# EasyEDA Pro project ProPrj_Sandro OrangePi CM5 Carrier Board_2024-09-12.epro, schematic Schematics

## Sheets
1 CM4 Carrier: Board Name: Board; Create Date: 2024-09-04; Page Name: CM4 Carrier; Project Name: Sandro OrangePi CM5 Carrier Board; Schematic Name: Schematics; Update Date: 2024-09-11
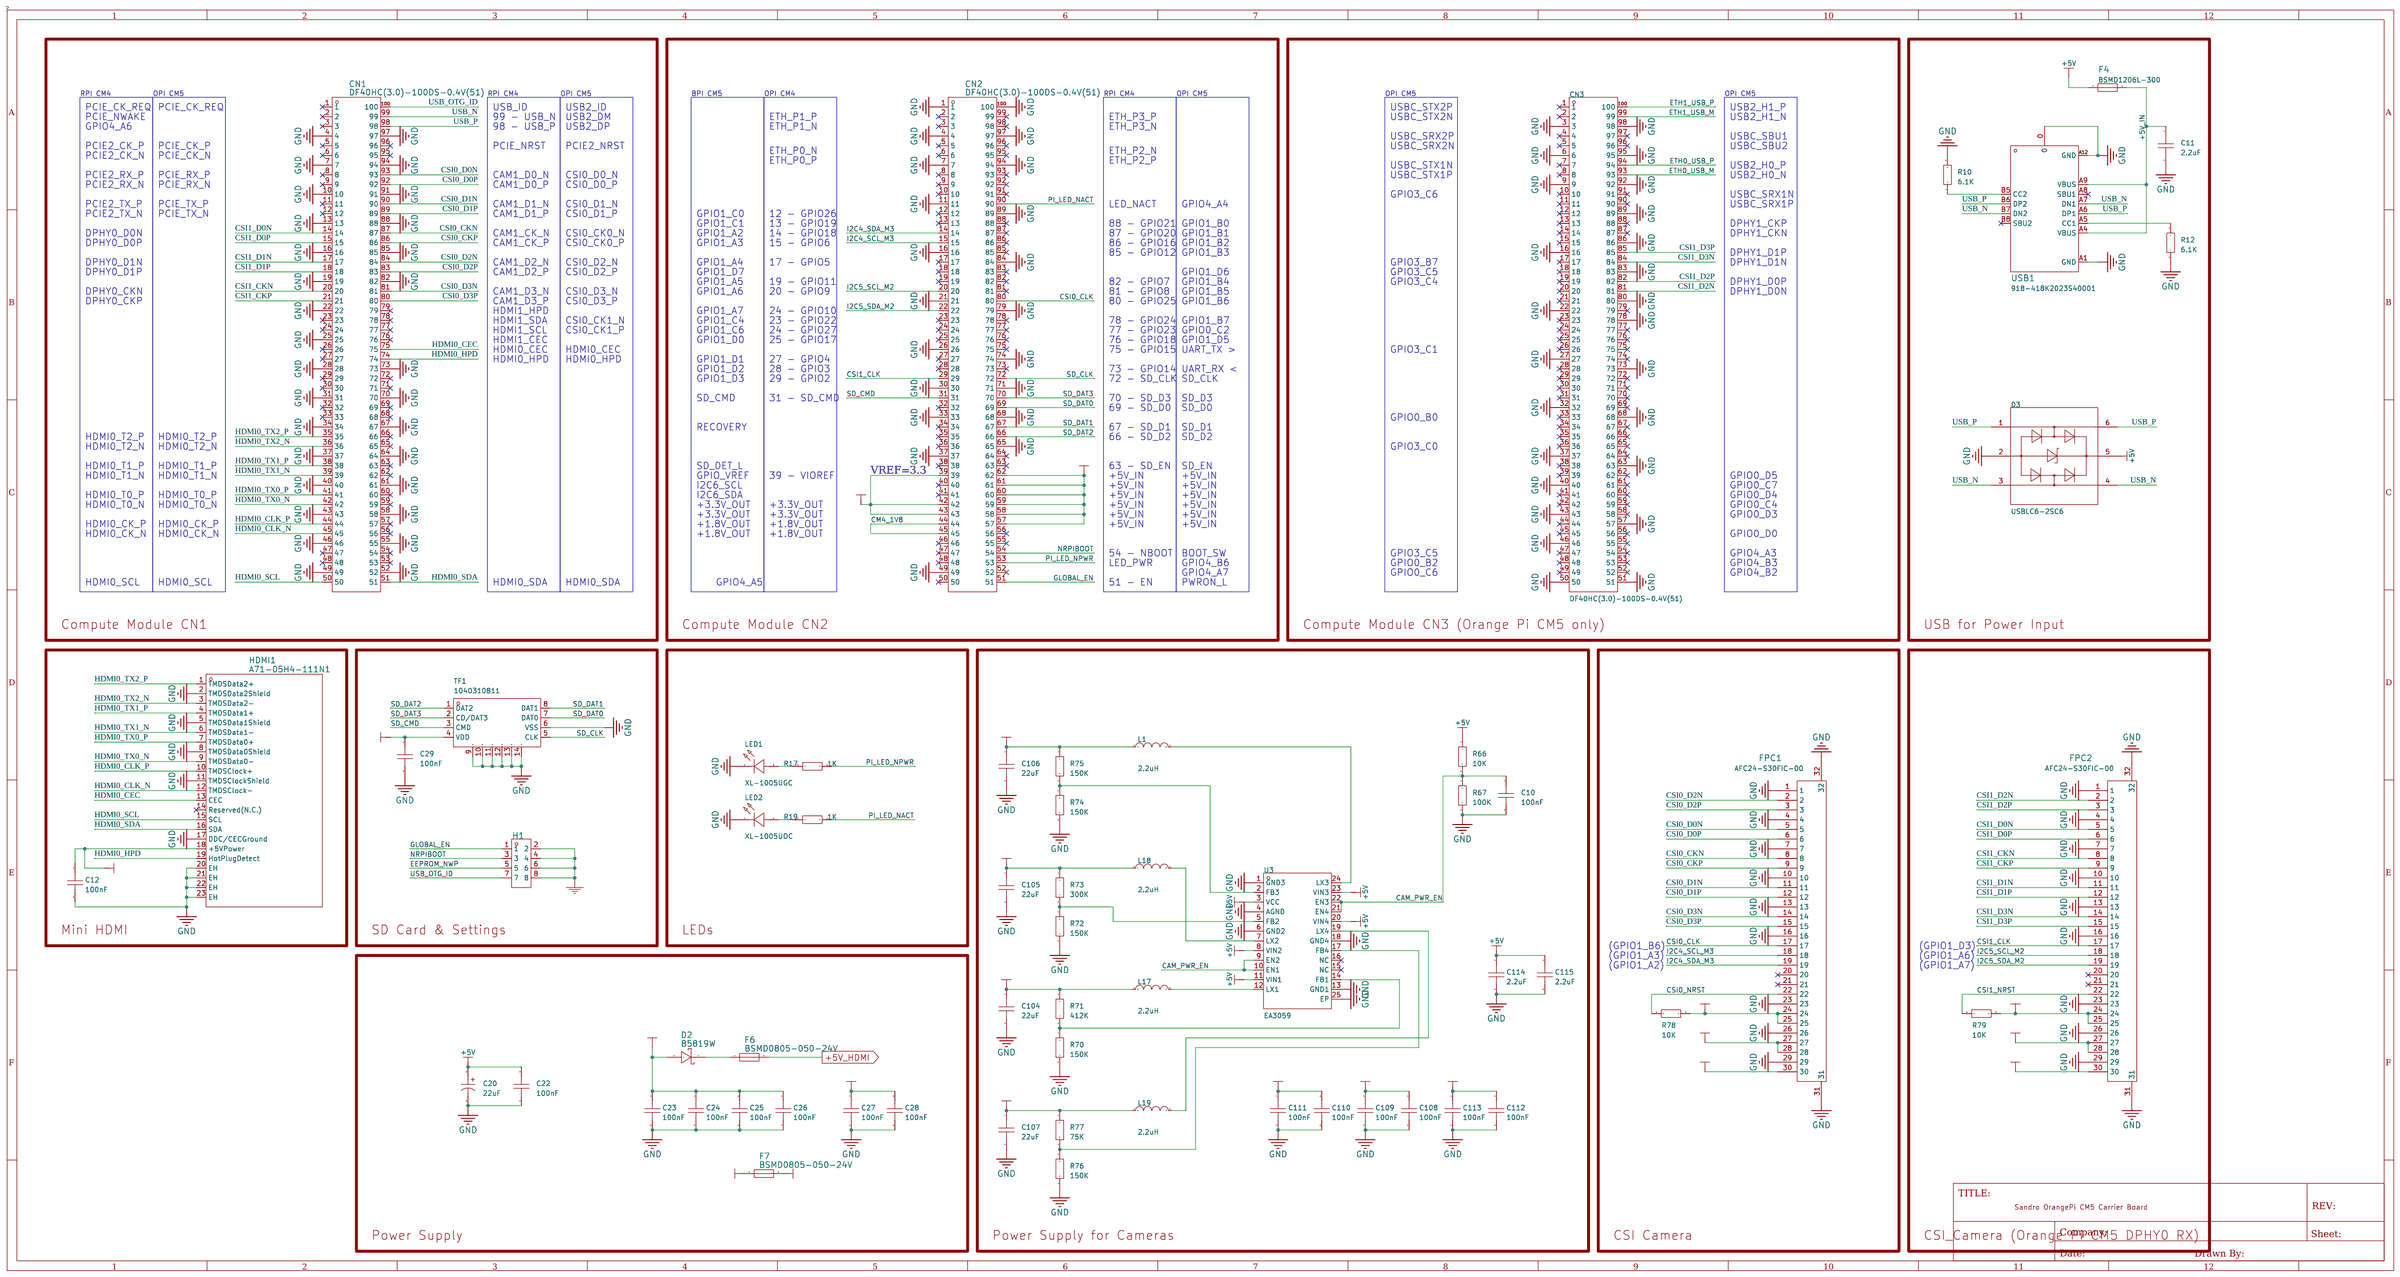
[diagram p0: CM4 Carrier]
2 2.Ethernet: Create Date: 2024-09-05
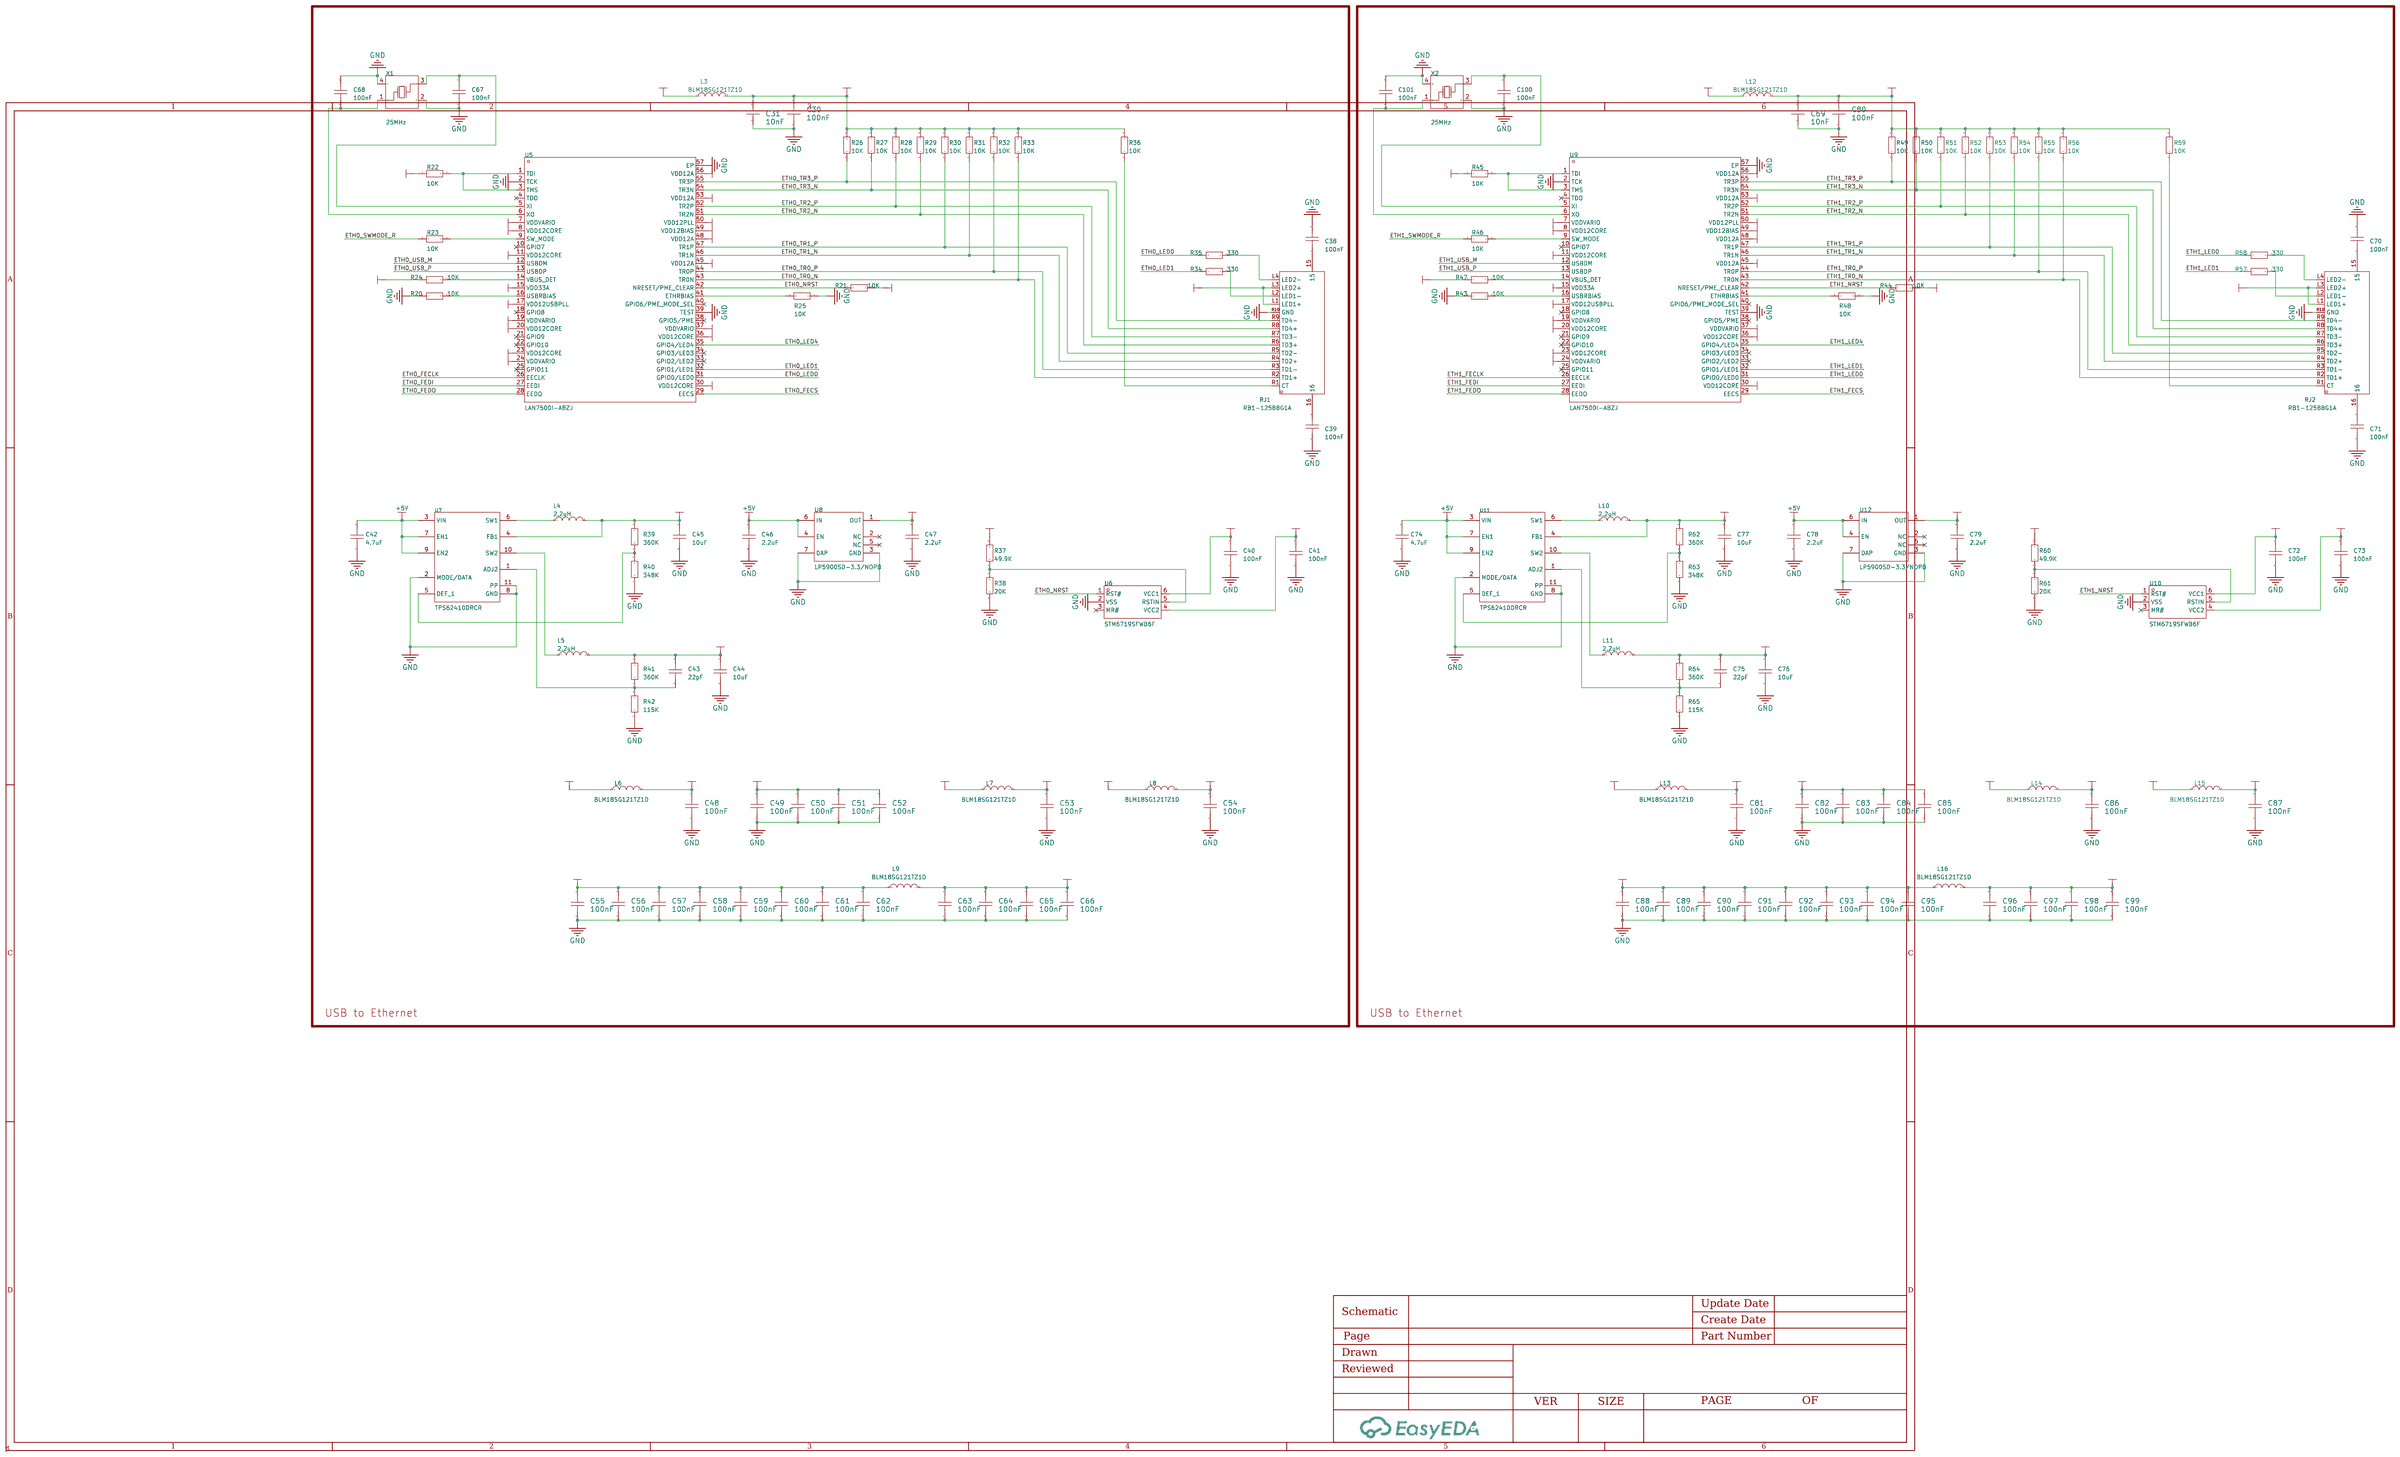
[diagram p1: 2.Ethernet]

## Parts
sheet 2.Ethernet
C30  100nF  [C0402]
C31  10nF  [C0402]
C38  100nF  [C0805]
C39  100nF  [C0805]
C40  100nF  [C0402]
C41  100nF  [C0402]
C42  4.7uF  [C0603]
C43  22pF  [C0402]
C44  10uF  [C0603]
C45  10uF  [C0603]
C46  2.2uF  [C0603]
C47  2.2uF  [C0603]
C48  100nF  [C0201]
C49  100nF  [C0201]
C50  100nF  [C0201]
C51  100nF  [C0201]
C52  100nF  [C0201]
C53  100nF  [C0201]
C54  100nF  [C0201]
C55  100nF  [C0201]
C56  100nF  [C0201]
C57  100nF  [C0201]
C58  100nF  [C0201]
C59  100nF  [C0201]
C60  100nF  [C0201]
C61  100nF  [C0201]
C62  100nF  [C0201]
C63  100nF  [C0201]
C64  100nF  [C0201]
C65  100nF  [C0201]
C66  100nF  [C0201]
C67  100nF  [C0201]
C68  100nF  [C0201]
C69  10nF  [C0402]
C70  100nF  [C0805]
C71  100nF  [C0805]
C72  100nF  [C0402]
C73  100nF  [C0402]
C74  4.7uF  [C0603]
C75  22pF  [C0402]
C76  10uF  [C0603]
C77  10uF  [C0603]
C78  2.2uF  [C0603]
C79  2.2uF  [C0603]
C80  100nF  [C0402]
C81  100nF  [C0201]
C82  100nF  [C0201]
C83  100nF  [C0201]
C84  100nF  [C0201]
C85  100nF  [C0201]
C86  100nF  [C0201]
C87  100nF  [C0201]
C88  100nF  [C0201]
C89  100nF  [C0201]
C90  100nF  [C0201]
C91  100nF  [C0201]
C92  100nF  [C0201]
C93  100nF  [C0201]
C94  100nF  [C0201]
C95  100nF  [C0201]
C96  100nF  [C0201]
C97  100nF  [C0201]
C98  100nF  [C0201]
C99  100nF  [C0201]
C100  100nF  [C0201]
C101  100nF  [C0201]
L3  BLM18SG121TZ1D  [L0603]
L4  2.2uH  [IND-SMD_L2.0-W1.6]
L5  2.2uH  [IND-SMD_L2.0-W1.6]
L6  BLM18SG121TZ1D  [L0603]
L7  BLM18SG121TZ1D  [L0603]
L8  BLM18SG121TZ1D  [L0603]
L9  BLM18SG121TZ1D  [L0603]
L10  2.2uH  [IND-SMD_L2.0-W1.6]
L11  2.2uH  [IND-SMD_L2.0-W1.6]
L12  BLM18SG121TZ1D  [L0603]
L13  BLM18SG121TZ1D  [L0603]
L14  BLM18SG121TZ1D  [L0603]
L15  BLM18SG121TZ1D  [L0603]
L16  BLM18SG121TZ1D  [L0603]
R20  10K  [R0201]
R21  10K  [R0201]
R22  10K  [R0201]
R23  10K  [R0201]
R24  10K  [R0201]
R25  10K  [R0201]
R26  10K  [R0201]
R27  10K  [R0201]
R28  10K  [R0201]
R29  10K  [R0201]
R30  10K  [R0201]
R31  10K  [R0201]
R32  10K  [R0201]
R33  10K  [R0201]
R34  330  [R0402]
R35  330  [R0402]
R36  10K  [R0201]
R37  49.9K  [R0402]
R38  20K  [R0402]
R39  360K  [R0402]
R40  348K  [R0402]
R41  360K  [R0402]
R42  115K  [R0402]
R43  10K  [R0201]
R44  10K  [R0201]
R45  10K  [R0201]
R46  10K  [R0201]
R47  10K  [R0201]
R48  10K  [R0201]
R49  10K  [R0201]
R50  10K  [R0201]
R51  10K  [R0201]
R52  10K  [R0201]
R53  10K  [R0201]
R54  10K  [R0201]
R55  10K  [R0201]
R56  10K  [R0201]
R57  330  [R0402]
R58  330  [R0402]
R59  10K  [R0201]
R60  49.9K  [R0402]
R61  20K  [R0402]
R62  360K  [R0402]
R63  348K  [R0402]
R64  360K  [R0402]
R65  115K  [R0402]
RJ1  RB1-125B8G1A  [RJ45-TH_RB1-125B8G1A]
RJ2  RB1-125B8G1A  [RJ45-TH_RB1-125B8G1A]
U5  LAN7500I-ABZJ  [QFN-56_L8.0-W8.0-P0.50-BL-EP6.0]
U6  STM6719SFWB6F  [SOT-23-6_L2.9-W1.6-P0.95-LS2.9-BL]
U7  TPS62410DRCR  [VSON-10_L3.0-W3.0-P0.50-BL-EP1.65]
U8  LP5900SD-3.3/NOPB  [WSON-6_L2.0-W2.0-P0.65-BL-EP]
U9  LAN7500I-ABZJ  [QFN-56_L8.0-W8.0-P0.50-BL-EP6.0]
U10  STM6719SFWB6F  [SOT-23-6_L2.9-W1.6-P0.95-LS2.9-BL]
U11  TPS62410DRCR  [VSON-10_L3.0-W3.0-P0.50-BL-EP1.65]
U12  LP5900SD-3.3/NOPB  [WSON-6_L2.0-W2.0-P0.65-BL-EP]
X1  25MHz  [OSC-SMD_4P-L3.2-W2.5-BL]
X2  25MHz  [OSC-SMD_4P-L3.2-W2.5-BL]
sheet CM4 Carrier
C10  100nF  [C0201]
C11  2.2uF  [C0603]
C12  100nF  [C0402]
C20  22uF  [CAP-SMD_L3.2-W1.6]
C22  100nF  [C0603]
C23  100nF  [C0402]
C24  100nF  [C0402]
C25  100nF  [C0402]
C26  100nF  [C0402]
C27  100nF  [C0402]
C28  100nF  [C0402]
C29  100nF  [C0402]
C104  22uF  [C0603]
C105  22uF  [C0603]
C106  22uF  [C0603]
C107  22uF  [C0603]
C108  100nF  [C0402]
C109  100nF  [C0402]
C110  100nF  [C0402]
C111  100nF  [C0402]
C112  100nF  [C0402]
C113  100nF  [C0402]
C114  2.2uF  [C0402]
C115  2.2uF  [C0402]
CN1  DF40HC(3.0)-100DS-0.4V(51)  [CONN-SMD_DF40HC-3.0-100DS-0.4V-51]
CN2  DF40HC(3.0)-100DS-0.4V(51)  [CONN-SMD_DF40HC-3.0-100DS-0.4V-51]
CN3  DF40HC(3.0)-100DS-0.4V(51)  [CONN-SMD_DF40HC-3.0-100DS-0.4V-51]
D2  B5819W  [SOD-123_L2.7-W1.6-LS3.7-RD-1]
D3  USBLC6-2SC6  [SOT-23-6_L2.9-W1.6-P0.95-LS2.8-BL]
F4  BSMD1206L-300  [F1206]
F6  BSMD0805-050-24V  [F0805]
F7  BSMD0805-050-24V  [F0805]
FPC1  AFC24-S30FIC-00  [FPC-SMD_P0.50-30P_QCHF-SM-H2.0]
FPC2  AFC24-S30FIC-00  [FPC-SMD_P0.50-30P_QCHF-SM-H2.0]
H1  2.54-2*4P立贴针  [HDR-SMD_8P-P2.54-V-M-R2-C4-LS7.4]
HDMI1  A71-05H4-111N1  [HDMI-SMD_A71-05H4-111N1]
L1  2.2uH  [IND-SMD_L2.0-W1.6]
L17  2.2uH  [IND-SMD_L2.0-W1.6]
L18  2.2uH  [IND-SMD_L2.0-W1.6]
L19  2.2uH  [IND-SMD_L2.0-W1.6]
LED1  XL-1005UGC  [LED0402-RD_GREEN]
LED2  XL-1005UOC  [LED0402-RD_ORANGE]
R10  6.1K  [R0402]
R12  6.1K  [R0402]
R17  1K  [R0402]
R19  1K  [R0402]
R66  10K  [R0201]
R67  100K  [R0201]
R70  150K  [R0201]
R71  412K  [R0201]
R72  150K  [R0201]
R73  300K  [R0201]
R74  150K  [R0201]
R75  150K  [R0201]
R76  150K  [R0201]
R77  75K  [R0201]
R78  10K  [R0402]
R79  10K  [R0402]
TF1  1040310811  [SIM-SMD_8P-1040310811]
U3  EA3059  [VQFN-24_L4.0-W4.0-P0.50-TL-EP2.5]
USB1  918-418K2023S40001  [USB-C-SMD_TYPE-C-USB-17]

## Library data of the parts
C30 C80 = GRM155R71H104KE14D: Capacitance: Tolerance:±10% Tolerance:±10% Voltage Rated: Temperature Coefficient:; LCSC Part Name: 100nF ±10% 50V; Supplier Part: C77020; Manufacturer: muRata(村田); Supplier Footprint: 0402; JLCPCB Part Class: Extended Part; Datasheet: https://atta.szlcsc.com/upload/public/pdf/source/20180326/C77020_39BD49C951FF1AF0DB1F1FAC5AC1E401.pdf; Supplier: LCSC; Tolerance: ±10%
C31 C69 = GRM155R71H103KA88D: Capacitance: Tolerance:±10% Tolerance:±10% Voltage Rated: Temperature Coefficient:; LCSC Part Name: 10nF ±10% 50V; Supplier Part: C77019; Manufacturer: muRata(村田); Supplier Footprint: 0402; JLCPCB Part Class: Extended Part; Datasheet: https://atta.szlcsc.com/upload/public/pdf/source/20180326/C77019_6A3693CE1BCE757D6A8B7C99DAE1B441.pdf; Supplier: LCSC; Tolerance: ±10%
C38 C39 C70 C71 = CAP_0805: Supplier Footprint: 0805
C12 C23-C29 C40 C41 C43 C72 C73 C75 C108-C115 = CAP_0402: Supplier Part: C1525; Supplier Footprint: 0402
C42 C74 = GRM188Z71C475KE21D: Capacitance: Tolerance:±10% Tolerance:±10% Voltage Rated: Temperature Coefficient:; LCSC Part Name: 4.7uF ±10% 16V; Supplier Part: C389010; Manufacturer: muRata(村田); Supplier Footprint: 0603; JLCPCB Part Class: Extended Part; Datasheet: https://atta.szlcsc.com/upload/public/pdf/source/20190418/C389010_378994D96815F6C3A9D8A85630794D48.pdf; Supplier: LCSC; Tolerance: ±10%
C11 C22 C44-C47 C76-C79 C104-C107 = CAP_0603: Supplier Footprint: 0603
C48-C66 C81-C99 = CAP_0201: Capacitance: Tolerance:±10% Tolerance:±10% Voltage Rated: Temperature Coefficient:; Supplier Footprint: 0201; LCSC Part Name: 100nF ±10% 50V; Datasheet: https://atta.szlcsc.com/upload/public/pdf/source/20180326/C77020_39BD49C951FF1AF0DB1F1FAC5AC1E401.pdf; Tolerance: ±10%
C10 C67 C68 C100 C101 = CAP_0201: Supplier Footprint: 0201
L3 L6-L9 L12-L16 = BLM18SG121TZ1D: Impedance @ Frequency:120Ω@100MHz Tolerance:±25% Tolerance:±25% DC Resistance:25mΩ Current Rating:3A Circuits:1; LCSC Part Name: 单路 0603磁珠 阻抗120Ω@100MHz; Supplier Part: C710390; Manufacturer: muRata(村田); Supplier Footprint: 0603; JLCPCB Part Class: Extended Part; Datasheet: https://atta.szlcsc.com/upload/public/pdf/source/20200713/C596493_97559AA8DE433E199BC44324FAB20584.pdf; Supplier: LCSC; Impedance @ Frequency: 120Ω@100MHz; Tolerance: ±25%; DC Resistance: 25mΩ; Current Rating: 3A; Circuits: 1
L1 L4 L5 L10 L11 L17-L19 = CKCS201610-2.2uH/M: Inductance: Tolerance:±20% Tolerance:±20% Rated Current: DC Resistance (DCR):; LCSC Part Name: 2.2uH ±20%; Supplier Part: C354533; Manufacturer: CENKER(岑科); Supplier Footprint: 0806; JLCPCB Part Class: Extended Part; Datasheet: https://atta.szlcsc.com/upload/public/pdf/source/20190315/C354623_FFFAD03D5912F156EAD6541D59E4BFA6.pdf; Supplier: LCSC; Tolerance: ±20%
R20-R33 R36 R43-R56 R59 R66 R67 R70-R77 = Res_0201: Supplier Footprint: 0201
R10 R12 R17 R19 R34 R35 R37-R42 R57 R58 R60-R65 R78 R79 = Res_0402: Supplier Footprint: 0402
RJ1 RJ2 = RB1-125B8G1A: Connector Type:RJ45Receptacle Number of Ports:1 Shielding:- LED:WithLED Ratings:-; LCSC Part Name: 带LED; Supplier Part: C363353; Manufacturer: UDE(涌德电子); Supplier Footprint: 插件; JLCPCB Part Class: Extended Part; Datasheet: https://atta.szlcsc.com/upload/public/pdf/source/20190109/C363353_EA6E4B83DC2B7D86FE894E4D2D926326.pdf; Supplier: LCSC; Connector Type: RJ45Receptacle; Number of Ports: 1; LED: WithLED
U5 U9 = LAN7500I-ABZJ: Supplier Part: C633487; Manufacturer: MICROCHIP(美国微芯); Supplier Footprint: QFN-56-EP(8x8); JLCPCB Part Class: Extended Part; Datasheet: https://atta.szlcsc.com/upload/public/pdf/source/20201223/C633487_9F806AA6E1D0B4E84D093B09D4D35190.pdf; Supplier: LCSC
U6 U10 = STM6719SFWB6F: ChipType:Multi-pressure monitor Output Type:开漏 Reset Active Level:低电平有效 Threshold Voltage:1.05V；2.925V Number of Voltages Monitored:3 Reset Timeout:140ms Operating Temperature:-40℃~+85℃@(TA) Operating Temperature:-40℃~+85℃@(TA); Supplier Part: C2066130; Manufacturer: ST(意法半导体); Supplier Footprint: SOT-23-6; JLCPCB Part Class: Extended Part; Datasheet: https://atta.szlcsc.com/upload/public/pdf/source/20191219/C472587_1763A85136DA7D01AAA8799638101CA1.pdf; Supplier: LCSC; ChipType: Multi-pressure monitor; Output Type: 开漏; Reset Active Level: 低电平有效; Threshold Voltage: 1.05V；2.925V; Number of Voltages Monitored: 3; Reset Timeout: 140ms; Operating Temperature: -40℃~+85℃@(TA)
U7 U11 = TPS62410DRCR: Function:Step-down type Output Type:Adjustable Input Voltage:2.5V~6V Input Voltage:2.5V~6V Output Voltage:600mV~6V Output Voltage:600mV~6V Output Current (Max):800mA Switching Frequency:2.25MHz Operating Temperature:-40℃~+85℃@(TA) Operating Temperature:-4; Supplier Part: C54570; Manufacturer: TI(德州仪器); Supplier Footprint: VSON-10-EP(3x3); JLCPCB Part Class: Extended Part; Datasheet: https://www.ti.com/cn/lit/gpn/tps62410; Supplier: LCSC; Function: Step-down type; Output Type: Adjustable; Input Voltage: 2.5V~6V; Output Voltage: 600mV~6V; Output Current (Max): 800mA; Switching Frequency: 2.25MHz; Operating Temperature: -40℃~+85℃@(TA); Synchronous Rectification: Yes; Number of Outputs: 2; Topology: Step-down; Switch tube (built-in/external): 内置
U8 U12 = LP5900SD-3.3/NOPB: Output Type:Fixed Maximum Input Voltage:5.5V Output Voltage:3.3V Output Voltage:3.3V Output Current:150mA Power Supply Rejection Ratio (PSRR):85dB Dropout Voltage:150mV@(150mA) Feature:防静电保护；Short-Circuit  Protection；低ESR；Thermal Protection(TSD)；欠压闭锁；带使能; LCSC Part Name: 具有使能功能的 150mA、低噪声、低 IQ、低压降稳压器; Supplier Part: C131975; Manufacturer: TI(德州仪器); Supplier Footprint: WSON-6-EP(2.2x2.5); JLCPCB Part Class: Extended Part; Datasheet: https://www.ti.com/cn/lit/gpn/lp5900; Supplier: LCSC; Output Type: Fixed; Maximum Input Voltage: 5.5V; Output Voltage: 3.3V; Output Current: 150mA; Power Supply Rejection Ratio (PSRR): 85dB; Dropout Voltage: 150mV@(150mA); Feature: 防静电保护；Short-Circuit  Protection；低ESR；Thermal Protection(TSD)；欠压闭锁；带使能; Output Polarity: Positive electrode; Number of Outputs: 1
X1 X2 = X322525MOB4SI: Crystal Type:Surface Mount Crystal Frequency: Normal temperature Frequency Tolerance:±10ppm Normal temperature Frequency Tolerance:±10ppm External load capacitor: Frequency Stability(Full temperature range):±20ppm Frequency Stability(Full temperature rang; LCSC Part Name: 25MHz ±10ppm 12pF; Supplier Part: C9006; Manufacturer: YXC(扬兴晶振); Supplier Footprint: SMD3225-4P; JLCPCB Part Class: Basic Part; Datasheet: https://atta.szlcsc.com/upload/public/pdf/source/20240329/19D5F850207469550BEB00D7DFEDBC7A.pdf; Supplier: LCSC; Crystal Type: Surface Mount Crystal; Normal temperature Frequency Tolerance: ±10ppm; Frequency Stability(Full temperature range): ±20ppm
C20 = CA45-A-16V-22uF-K: Capacitance: Tolerance:±10% Tolerance:±10% Rated Voltage: Equivalent Series Resistance(ESR):6Ω@100kHz Operating Temperature:-55℃~+125℃ Operating Temperature:-55℃~+125℃; LCSC Part Name: 22uF ±10% 16V; Supplier Part: C782264; Manufacturer: CEC(振华新云); Supplier Footprint: CASE-A-3216; JLCPCB Part Class: Extended Part; Datasheet: https://atta.szlcsc.com/upload/public/pdf/source/20200909/C782264_D6D9C4EF3B25E81633C26A9294FBB820.pdf; Supplier: LCSC; Tolerance: ±10%; Equivalent Series Resistance(ESR): 6Ω@100kHz; Operating Temperature: -55℃~+125℃
CN1 CN2 = DF40HC(3.0)-100DS-0.4V(51): link: https://item.szlcsc.com/418166.html; Supplier: LCSC; Supplier Part: C424649; Manufacturer: HRS(广濑); JLCPCB Part Class: Extended Part
CN3 = DF40HC(3.0)-100DS-0.4V(51): Number of Pins:- Pitch:0.4mm Gender:Female Mounting Style:Brick nogging Number of Rows:2 Current Rating (Max):300mA Contact Plating:Gold Operating Temperature Range:-35℃~+85℃ Operating Temperature Range:-35℃~+85℃; LCSC Part Name: 间距:0.4mm 母 立贴; Supplier Part: C424649; Manufacturer: HRS(广濑); Supplier Footprint: SMD,P=0.4mm; JLCPCB Part Class: Extended Part; Datasheet: https://atta.szlcsc.com/upload/public/pdf/source/20190903/C424648_4BEB475664B3701E3114D0DD20EED667.pdf; Supplier: LCSC; Pitch: 0.4mm; Gender: Female; Mounting Style: Brick nogging; Number of Rows: 2; Current Rating (Max): 300mA; Contact Plating: Gold; Operating Temperature Range: -35℃~+85℃
D2 = B5819W: link: https://atta.szlcsc.com/upload/public/pdf/source/20210423/C2828417_EF1BF8BE3D48F97E320B09B073C89160.pdf; Supplier: LCSC; Manufacturer: CJ; Supplier Part: C8598; JLCPCB Part Class: Basic Part
D3 = USBLC6-2SC6_C7519: polarity:Unidirectional Reverse Stand-Off Voltage (Vrwm):5.25V Maximum Clamping Voltage:17V Peak Pulse Current (Ipp)@10/1000us:5A Breakdown Voltage:6V Number of Lines:双路 Operating Temperature:-40℃~+125℃@(Tj) Operating Temperature:-40℃~+125℃@(Tj) Type:ESD; LCSC Part Name: 单向ESD; Supplier Part: C7519; Manufacturer: ST(意法半导体); Supplier Footprint: SOT-23-6; JLCPCB Part Class: Extended Part; Datasheet: https://atta.szlcsc.com/upload/public/pdf/source/20140724/1457707160627.pdf; Supplier: LCSC; polarity: Unidirectional; Reverse Stand-Off Voltage (Vrwm): 5.25V; Maximum Clamping Voltage: 17V; Peak Pulse Current (Ipp)@10/1000us: 5A; Breakdown Voltage: 6V; Number of Lines: 双路; Operating Temperature: -40℃~+125℃@(Tj); Type: ESD
F4 = BSMD1206L-300: Operating Voltage (Max):6V Current Rating (Max):50A Hold Current:3A Trip Current:6A Power Dissipation:1.2W Resistance - Initial (Ri) (Min):3mΩ Resistance - Post Trip (R1) (Max):30mΩ Maximum Time to Trip:5s Operating Temperature:-40℃~+85℃ Operating Tempera; LCSC Part Name: 1206 3A 6V 佰宏低电阻; Supplier Part: C960021; Manufacturer: BHFUSE(佰宏); Supplier Footprint: 1206; JLCPCB Part Class: Extended Part; Datasheet: https://atta.szlcsc.com/upload/public/pdf/source/20230512/A1E7B7D17B41A33ACDAB0D28E5E34190.pdf; Supplier: LCSC; Operating Voltage (Max): 6V; Current Rating (Max): 50A; Hold Current: 3A; Trip Current: 6A; Power Dissipation: 1.2W; Resistance - Initial (Ri) (Min): 3mΩ; Resistance - Post Trip (R1) (Max): 30mΩ; Maximum Time to Trip: 5s; Operating Temperature: -40℃~+85℃
F6 F7 = BSMD0805-050-24V: link: https://item.szlcsc.com/343298.html; 3DModel: F0805_L2.1-W1.4-H0.8; Supplier: LCSC; Supplier Part: C910822; Manufacturer: BHFUSE; JLCPCB Part Class: Extended Part
FPC1 FPC2 = AFC24-S30FIC-00: Locking Feature:Clamshell Contact Type:Double-sided contacts/up and down connection Number of Contacts:30P Pitch:0.5mm Mounting Type:卧贴 FFC, FCB Thickness:0.3mm FFC, FCB Thickness:0.3mm Height Above Board:2mm; LCSC Part Name: 间距:0.5mm P数:30P 翻盖式 双侧触点/上下接; Supplier Part: C262294; Manufacturer: JS(钜硕电子); Supplier Footprint: SMD,P=0.5mm,卧贴; JLCPCB Part Class: Extended Part; Datasheet: https://atta.szlcsc.com/upload/public/pdf/source/20180814/C262679_7FB2CAD07E71B2E22E52A118EE33337B.pdf; Supplier: LCSC; Locking Feature: Clamshell; Contact Type: Double-sided contacts/up and down connection; Number of Contacts: 30P; Pitch: 0.5mm; Mounting Type: 卧贴; FFC, FCB Thickness: 0.3mm; Height Above Board: 2mm
H1 = 2.54-2*4P立贴针: Pin Structure:2x4P Pitch:2.54mm Row Spacing:2.54mm Circluar Pins/Square Pins:Square Pins Mounting Type:Brick nogging Number of Rows:双排 Number of Pins:8P Current Rating (Max):3A Voltage Rating (Max):- Length of Mating Pin:6mm Insulation Height:2.5mm Length; LCSC Part Name: 间距:2.54mm 2x4P 立贴 方针; Supplier Part: C192300; Manufacturer: BOOMELE(博穆精密); Supplier Footprint: SMD,P=2.54mm; JLCPCB Part Class: Extended Part; Datasheet: https://atta.szlcsc.com/upload/public/pdf/source/20210812/F9D0E068B6990BF98BEA9D68FBD6ED36.pdf; Supplier: LCSC; Pin Structure: 2x4P; Pitch: 2.54mm; Row Spacing: 2.54mm; Circluar Pins/Square Pins: Square Pins; Mounting Type: Brick nogging; Number of Rows: 双排; Number of Pins: 8P; Current Rating (Max): 3A; Length of Mating Pin: 6mm; Insulation Height: 2.5mm; Operating Temperature Range: -55℃~+105℃; Color: Black
HDMI1 = A71-05H4-111N1: link: https://atta.szlcsc.com/upload/public/pdf/source/20210514/C2682170_4D6E5A791C7E19ACB30FBEFC75C1BA4F.pdf; Supplier: LCSC; Supplier Part: C2682170; Manufacturer: XKB Connectivity(中国星坤); JLCPCB Part Class: Extended Part
LED1 = XL-1005UGC_C965793: Emitted Color:Emerald Forward Voltage (VF):3V Forward Voltage (VF):3V Power Dissipation:80mW Forward Current:25mA Dominant Wavelength:516nm~531nm Dominant Wavelength:516nm~531nm Peak Wavelength:531nm Lens Color:Colorless and transparent Color Temperature:; Supplier Part: C965793; Manufacturer: XINGLIGHT(成兴光); Supplier Footprint: 0402; JLCPCB Part Class: Extended Part; Datasheet: https://atta.szlcsc.com/upload/public/pdf/source/20201230/C965793_0CDDD21E721E0FD2A4CEAFDFDBC3C135.pdf; Supplier: LCSC; Emitted Color: Emerald; Forward Voltage (VF): 3V; Power Dissipation: 80mW; Forward Current: 25mA; Dominant Wavelength: 516nm~531nm; Peak Wavelength: 531nm; Lens Color: Colorless and transparent; Luminous Intensity: 249mcd; Viewing Angle: 120°; Mounting Sytle: Positive Stick; Operating Temperature: -30℃~+85℃
LED2 = XL-1005UOC: Emitted Color:Orange Power Dissipation:55mW Forward Current:25mA Dominant Wavelength:600nm Dominant Wavelength:600nm Peak Wavelength:610nm Lens Color:无色透明透镜 Color Temperature:- Color Temperature:- Viewing Angle:120° Mounting Sytle:Positive post Operating; Supplier Part: C965791; Manufacturer: XINGLIGHT(成兴光); Supplier Footprint: 0402; JLCPCB Part Class: Extended Part; Datasheet: https://atta.szlcsc.com/upload/public/pdf/source/20221102/20343CDAB7C90B2E3EF3073DFAD545BA.pdf; Supplier: LCSC; Emitted Color: Orange; Power Dissipation: 55mW; Forward Current: 25mA; Dominant Wavelength: 600nm; Peak Wavelength: 610nm; Lens Color: 无色透明透镜; Viewing Angle: 120°; Mounting Sytle: Positive post; Operating Temperature: -30℃~+85℃
TF1 = 1040310811: Card Connection Mode:Pluggable Card Type:MicroSD卡(TF卡) Connector Type:Deck Maximum Body Height:1.42mm Contact Plating:Gold Operating Temperature Range:- Operating Temperature Range:-; LCSC Part Name: 拔插式 MicroSD卡(TF卡) 卡座; Supplier Part: C585350; Manufacturer: MOLEX; Supplier Footprint: SMD; JLCPCB Part Class: Extended Part; Datasheet: https://atta.szlcsc.com/upload/public/pdf/source/20201117/C585350_D1F0B30BD23514449186B2E50ACE8BBF.pdf; Supplier: LCSC; Card Connection Mode: Pluggable; Card Type: MicroSD卡(TF卡); Connector Type: Deck; Maximum Body Height: 1.42mm; Contact Plating: Gold
U3 = EA3059: The Chip Type:- Supply Voltage:2.7V~5.5V Supply Voltage:2.7V~5.5V Maximum Charge Current:- Charging Saturation Voltage:- End-Off Voltage:- Type of Battery:- Number of Cells:4 Number of Cells:4 Operating Temperature:- Operating Temperature:-; Supplier Part: C111586; Manufacturer: everanalog(申风); Supplier Footprint: QFN-24-EP(4x4); JLCPCB Part Class: Extended Part; Supplier: LCSC; Supply Voltage: 2.7V~5.5V; Number of Cells: 4
USB1 = 918-418K2023S40001: Connector Type:Type-C Standard:- Gender:Female Number of Contacts:16 Number of Ports:1 Current Rating - Power (Max):3A; LCSC Part Name: Type-C 母座; Supplier Part: C167321; Manufacturer: 精拓金; Supplier Footprint: SMD; JLCPCB Part Class: Extended Part; Datasheet: https://atta.szlcsc.com/upload/public/pdf/source/20210305/C167321_3BB79E85CEB6874BF587E64926D16F83.pdf; Supplier: LCSC; Connector Type: Type-C; Gender: Female; Number of Contacts: 16; Number of Ports: 1; Current Rating - Power (Max): 3A

## Nets
0V9: C107.1 L19.1 R77.1
3V3: C29.1 F7.2 TF1.4(VDD)
+5V: C20.1 C22.1 C23.1 C24.1 C25.1 C26.1 C42.2 C46.1 C74.2 C78.1 C114.1 C115.1 CN2.57 CN2.58 CN2.59 CN2.60 CN2.61 CN2.62 D2.2(+) D3.5 F4.1 R66.1 U3.3(VCC) U3.8(VIN2) U3.11(VIN1) U3.20(VIN4) U3.23(VIN3) U7.3(VIN) U7.7(EN1) U7.9(EN2) U8.4(EN) U8.6(IN) U11.3(VIN) U11.7(EN1) U11.9(EN2) U12.4(EN) U12.6(IN)
+5V_HDMI: C12.1 F6.2 HDMI1.18(+5VPower)
+5V_IN: C11.1 F4.2 USB1.A4(VBUS) USB1.A9(VBUS)
GND: C10.2 C11.2 C12.2 C20.2 C22.2 C23.2 C24.2 C25.2 C26.2 C27.2 C28.2 C29.2 C30.1 C31.1 C38.2 C39.1 C40.2 C41.2 C42.1 C44.2 C45.2 C46.2 C47.2 C48.1 C49.1 C50.1 C51.1 C52.1 C53.1 C54.1 C55.1 C56.1 C57.1 C58.1 C59.1 C60.1 C61.1 C62.1 C63.1 C64.1 C65.1 C66.1 C67.2 C68.1 C69.1 C70.2 C71.1 C72.2 C73.2 C74.1 C76.2 C77.2 C78.2 C79.2 C80.1 C81.1 C82.1 C83.1 C84.1 C85.1 C86.1 C87.1 C88.1 C89.1 C90.1 C91.1 C92.1 C93.1 C94.1 C95.1 C96.1 C97.1 C98.1 C99.1 C100.2 C101.1 C104.2 C105.2 C106.2 C107.2 C108.2 C109.2 C110.2 C111.2 C112.2 C113.2 C114.2 C115.2 CN1.4 CN1.7 CN1.10 CN1.13 CN1.16 CN1.19 CN1.22 CN1.25 CN1.28 CN1.31 CN1.34 CN1.37 CN1.40 CN1.43 CN1.46 CN1.49 CN1.52 CN1.55 CN1.58 CN1.61 CN1.64 CN1.67 CN1.70 CN1.73 CN1.82 CN1.85 CN1.88 CN1.91 CN1.94 CN1.97 CN2.1 CN2.4 CN2.7 CN2.11 CN2.16 CN2.21 CN2.26 CN2.30 CN2.33 CN2.37 CN2.49 CN2.65 CN2.68 CN2.71 CN2.74 CN2.79 CN2.84 CN2.89 CN2.94 CN2.97 CN2.100 CN3.3 CN3.6 CN3.9 CN3.16 CN3.22 CN3.27 CN3.32 CN3.37 CN3.40 CN3.43 CN3.46 CN3.50 CN3.51 CN3.57 CN3.63 CN3.68 CN3.73 CN3.78 CN3.80 CN3.83 CN3.86 CN3.89 CN3.92 CN3.95 CN3.98 D3.2 FPC1.1 FPC1.4 FPC1.7 FPC1.10 FPC1.13 FPC1.16 FPC1.23 FPC1.26 FPC1.29 FPC1.31 FPC1.32 FPC2.1 FPC2.4 FPC2.7 FPC2.10 FPC2.13 FPC2.16 FPC2.23 FPC2.26 FPC2.29 FPC2.31 FPC2.32 H1.2 H1.4 H1.6 H1.8 HDMI1.2(TMDSData2Shield) HDMI1.5(TMDSData1Shield) HDMI1.8(TMDSData0Shield) HDMI1.11(TMDSClockShield) HDMI1.17(DDC/CECGround) HDMI1.20(EH) HDMI1.21(EH) HDMI1.22(EH) HDMI1.23(EH) LED1.1(K) LED2.1(K) R10.2 R12.1 R20.1 R25.1 R38.1 R40.1 R42.1 R43.1 R48.1 R61.1 R63.1 R65.1 R67.2 R70.2 R72.2 R74.2 R76.2 RJ1.R10(GND) RJ2.R10(GND) TF1.6(VSS) TF1.9 TF1.10 TF1.11 TF1.12 TF1.13 TF1.14 U3.1(GND3) U3.4(AGND) U3.6(GND2) U3.13(GND1) U3.18(GND4) U3.25(EP) U5.2(TCK) U5.39(TEST) U5.57(EP) U6.2(VSS) U7.2(MODE/DATA) U7.8(GND) U7.11(PP) U8.3(GND) U8.7(DAP) U9.2(TCK) U9.39(TEST) U9.57(EP) U10.2(VSS) U11.2(MODE/DATA) U11.8(GND) U11.11(PP) U12.3(GND) U12.7(DAP) USB1.0 USB1.A1(GND) USB1.A12(GND) X1.2(GND) X1.4(GND) X2.2(GND) X2.4(GND)
CAM_1V2: C106.1 C112.1 C113.1 FPC1.27 FPC1.28 FPC2.27 FPC2.28 L1.1 R75.1
CAM_1V8: C105.1 C108.1 C109.1 FPC1.30 FPC2.30 L18.1 R73.1
CAM_2V8: C104.1 C110.1 C111.1 FPC1.24 FPC1.25 FPC2.24 FPC2.25 L17.1 R71.1 R78.2 R79.2
CAM_PWR_EN: C10.1 R66.2 R67.1 U3.9(EN2) U3.10(EN1) U3.21(EN4) U3.22(EN3)
CM4_1V8: CN2.44 CN2.45
CM4_3V3: C27.1 C28.1 CN2.39 CN2.42 CN2.43 F7.1
CSI0_CKN: CN1.87 FPC1.8
CSI0_CKP: CN1.86 FPC1.9
CSI0_CLK: CN2.80 FPC1.17
CSI0_D0N: CN1.93 FPC1.5
CSI0_D0P: CN1.92 FPC1.6
CSI0_D1N: CN1.90 FPC1.11
CSI0_D1P: CN1.89 FPC1.12
CSI0_D2N: CN1.84 FPC1.2
CSI0_D2P: CN1.83 FPC1.3
CSI0_D3N: CN1.81 FPC1.14
CSI0_D3P: CN1.80 FPC1.15
CSI0_NRST: FPC1.22 R78.1
CSI1_CKN: CN1.20 FPC2.8
CSI1_CKP: CN1.21 FPC2.9
CSI1_CLK: CN2.29 FPC2.17
CSI1_D0N: CN1.14 FPC2.5
CSI1_D0P: CN1.15 FPC2.6
CSI1_D1N: CN1.17 FPC2.11
CSI1_D1P: CN1.18 FPC2.12
CSI1_D2N: CN3.81 FPC2.2
CSI1_D2P: CN3.82 FPC2.3
CSI1_D3N: CN3.84 FPC2.14
CSI1_D3P: CN3.85 FPC2.15
CSI1_NRST: FPC2.22 R79.1
EEPROM_NWP: H1.5
ETH0_1V2: C41.1 C45.1 C55.2 C56.2 C57.2 C58.2 C59.2 C60.2 C61.2 C62.2 L4.2 L7.1 L8.1 L9.1 R39.2 U5.8(VDD12CORE) U5.11(VDD12CORE) U5.20(VDD12CORE) U5.23(VDD12CORE) U5.30(VDD12CORE) U5.36(VDD12CORE) U5.49(VDD12BIAS) U6.4(VCC2) U7.4(FB1)
ETH0_1V2A: C63.2 C64.2 C65.2 C66.2 L9.2 U5.45(VDD12A) U5.48(VDD12A) U5.53(VDD12A) U5.56(VDD12A)
ETH0_1V2PLL: C54.2 L8.2 U5.50(VDD12PLL)
ETH0_1V2USBPLL: C53.2 L7.2 U5.17(VDD12USBPLL)
ETH0_2V5: C43.1 C44.1 C49.2 C50.2 C51.2 C52.2 L3.1 L5.2 R21.2 R22.1 R24.1 R37.2 R41.2 U5.7(VDDVARIO) U5.19(VDDVARIO) U5.24(VDDVARIO) U5.37(VDDVARIO)
ETH0_2V5A_PHY: C30.2 C31.2 L3.2 R26.2 R27.2 R28.2 R29.2 R30.2 R31.2 R32.2 R33.2 R36.2 RJ1.L1(LED1+) RJ1.L3(LED2+)
ETH0_3V3: C40.1 C47.1 L6.1 U6.6(VCC1) U8.1(OUT)
ETH0_3V3A: C48.2 L6.2 U5.15(VDD33A)
ETH0_FECLK: U5.26(EECLK)
ETH0_FECS: U5.29(EECS)
ETH0_FEDI: U5.27(EEDI)
ETH0_FEDO: U5.28(EEDO)
ETH0_LED0: R35.1 U5.31(GPIO0/LED0)
ETH0_LED1: R34.1 U5.32(GPIO1/LED1)
ETH0_LED4: U5.35(GPIO4/LED4)
ETH0_NRST: R21.1 U5.42(NRESET/PME_CLEAR) U6.1(RST#)
ETH0_SWMODE_R: R23.1
ETH0_TR0_N: R33.1 RJ1.R2(TD1+) U5.43(TR0N)
ETH0_TR0_P: R32.1 RJ1.R3(TD1-) U5.44(TR0P)
ETH0_TR1_N: R31.1 RJ1.R4(TD2+) U5.46(TR1N)
ETH0_TR1_P: R30.1 RJ1.R5(TD2-) U5.47(TR1P)
ETH0_TR2_N: R29.1 RJ1.R6(TD3+) U5.51(TR2N)
ETH0_TR2_P: R28.1 RJ1.R7(TD3-) U5.52(TR2P)
ETH0_TR3_N: R27.1 RJ1.R8(TD4+) U5.54(TR3N)
ETH0_TR3_P: R26.1 RJ1.R9(TD4-) U5.55(TR3P)
ETH0_USB_M: CN3.93 U5.12(USBDM)
ETH0_USB_P: CN3.94 U5.13(USBDP)
ETH1_1V2: C73.1 C77.1 C88.2 C89.2 C90.2 C91.2 C92.2 C93.2 C94.2 C95.2 L10.2 L14.1 L15.1 L16.1 R62.2 U9.8(VDD12CORE) U9.11(VDD12CORE) U9.20(VDD12CORE) U9.23(VDD12CORE) U9.30(VDD12CORE) U9.36(VDD12CORE) U9.49(VDD12BIAS) U10.4(VCC2) U11.4(FB1)
ETH1_1V2A: C96.2 C97.2 C98.2 C99.2 L16.2 U9.45(VDD12A) U9.48(VDD12A) U9.53(VDD12A) U9.56(VDD12A)
ETH1_1V2PLL: C87.2 L15.2 U9.50(VDD12PLL)
ETH1_1V2USBPLL: C86.2 L14.2 U9.17(VDD12USBPLL)
ETH1_2V5: C75.1 C76.1 C82.2 C83.2 C84.2 C85.2 L11.2 L12.1 R44.2 R45.1 R47.1 R60.2 R64.2 U9.7(VDDVARIO) U9.19(VDDVARIO) U9.24(VDDVARIO) U9.37(VDDVARIO)
ETH1_2V5A_PHY: C69.2 C80.2 L12.2 R49.2 R50.2 R51.2 R52.2 R53.2 R54.2 R55.2 R56.2 R59.2 RJ2.L1(LED1+) RJ2.L3(LED2+)
ETH1_3V3: C72.1 C79.1 L13.1 U10.6(VCC1) U12.1(OUT)
ETH1_3V3A: C81.2 L13.2 U9.15(VDD33A)
ETH1_FECLK: U9.26(EECLK)
ETH1_FECS: U9.29(EECS)
ETH1_FEDI: U9.27(EEDI)
ETH1_FEDO: U9.28(EEDO)
ETH1_LED0: R58.1 U9.31(GPIO0/LED0)
ETH1_LED1: R57.1 U9.32(GPIO1/LED1)
ETH1_LED4: U9.35(GPIO4/LED4)
ETH1_NRST: R44.1 U9.42(NRESET/PME_CLEAR) U10.1(RST#)
ETH1_SWMODE_R: R46.1
ETH1_TR0_N: R56.1 RJ2.R2(TD1+) U9.43(TR0N)
ETH1_TR0_P: R55.1 RJ2.R3(TD1-) U9.44(TR0P)
ETH1_TR1_N: R54.1 RJ2.R4(TD2+) U9.46(TR1N)
ETH1_TR1_P: R53.1 RJ2.R5(TD2-) U9.47(TR1P)
ETH1_TR2_N: R52.1 RJ2.R6(TD3+) U9.51(TR2N)
ETH1_TR2_P: R51.1 RJ2.R7(TD3-) U9.52(TR2P)
ETH1_TR3_N: R50.1 RJ2.R8(TD4+) U9.54(TR3N)
ETH1_TR3_P: R49.1 RJ2.R9(TD4-) U9.55(TR3P)
ETH1_USB_M: CN3.99 U9.12(USBDM)
ETH1_USB_P: CN3.100 U9.13(USBDP)
GLOBAL_EN: CN2.51 H1.1
HDMI0_CEC: CN1.75 HDMI1.13(CEC)
HDMI0_CLK_N: CN1.45 HDMI1.12(TMDSClock-)
HDMI0_CLK_P: CN1.44 HDMI1.10(TMDSClock+)
HDMI0_HPD: CN1.74 HDMI1.19(HotPlugDetect)
HDMI0_SCL: CN1.50 HDMI1.15(SCL)
HDMI0_SDA: CN1.51 HDMI1.16(SDA)
HDMI0_TX0_N: CN1.42 HDMI1.9(TMDSData0-)
HDMI0_TX0_P: CN1.41 HDMI1.7(TMDSData0+)
HDMI0_TX1_N: CN1.39 HDMI1.6(TMDSData1-)
HDMI0_TX1_P: CN1.38 HDMI1.4(TMDSData1+)
HDMI0_TX2_N: CN1.36 HDMI1.3(TMDSData2-)
HDMI0_TX2_P: CN1.35 HDMI1.1(TMDSData2+)
I2C4_SCL_M3: CN2.15 FPC1.18
I2C4_SDA_M3: CN2.14 FPC1.19
I2C5_SCL_M2: CN2.20 FPC2.18
I2C5_SDA_M2: CN2.22 FPC2.19
NRPIBOOT: CN2.54 H1.3
PI_LED_NACT: CN2.90 R19.2
PI_LED_NPWR: CN2.53 R17.2
SD_CLK: CN2.72 TF1.5(CLK)
SD_CMD: CN2.31 TF1.3(CMD)
SD_DAT0: CN2.69 TF1.7(DAT0)
SD_DAT1: CN2.67 TF1.8(DAT1)
SD_DAT2: CN2.66 TF1.1(DAT2)
SD_DAT3: CN2.70 TF1.2(CD/DAT3)
USB_N: CN1.99 D3.3 D3.4 USB1.A7(DN1) USB1.B7(DN2)
USB_OTG_ID: CN1.100 H1.7
USB_P: CN1.98 D3.1 D3.6 USB1.A6(DP1) USB1.B6(DP2)
$1N7913: D2.1(-) F6.1
$1N10381: LED1.2(A) R17.1
$1N10468: LED2.2(A) R19.1
$1N13353: R12.2 USB1.A5(CC1)
$1N13354: R10.1 USB1.B5(CC2)
$1N27058: L17.2 U3.12(LX1)
$1N27059: R70.1 R71.2 U3.14(FB1)
$1N27066: R72.1 R73.2 U3.5(FB2)
$1N27067: L18.2 U3.7(LX2)
$1N27071: R74.1 R75.2 U3.2(FB3)
$1N27072: L1.2 U3.24(LX3)
$1N27076: R76.1 R77.2 U3.17(FB4)
$1N27077: L19.2 U3.19(LX4)
$2N494: R20.2 U5.16(USBRBIAS)
$2N1016: R22.2 U5.1(TDI) U5.3(TMS)
$2N1049: R23.2 U5.9(SW_MODE)
$2N1115: R24.2 U5.14(VBUS_DET)
$2N1157: R25.2 U5.41(ETHRBIAS)
$2N2277: R34.2 RJ1.L2(LED1-)
$2N2278: R35.2 RJ1.L4(LED2-)
$2N2283: C38.1 RJ1.15
$2N2284: C39.2 RJ1.16
$2N2472: R36.1 RJ1.R1(CT)
$2N2725: R37.1 R38.2 U6.5(RSTIN)
$2N3364: L4.1 U7.6(SW1)
$2N3421: R39.1 R40.2 U7.5(DEF_1)
$2N3543: L5.1 U7.10(SW2)
$2N3608: C43.2 R41.1 R42.2 U7.1(ADJ2)
$2N5341: C67.1 U5.5(XI) X1.3(OSC2)
$2N8589: R43.2 U9.16(USBRBIAS)
$2N8661: R45.2 U9.1(TDI) U9.3(TMS)
$2N8669: R46.2 U9.9(SW_MODE)
$2N8673: R47.2 U9.14(VBUS_DET)
$2N8677: R48.2 U9.41(ETHRBIAS)
$2N8743: R57.2 RJ2.L2(LED1-)
$2N8746: R58.2 RJ2.L4(LED2-)
$2N8751: C70.1 RJ2.15
$2N8752: C71.2 RJ2.16
$2N8753: R59.1 RJ2.R1(CT)
$2N8778: R60.1 R61.2 U10.5(RSTIN)
$2N8810: L10.1 U11.6(SW1)
$2N8818: R62.1 R63.2 U11.5(DEF_1)
$2N8825: L11.1 U11.10(SW2)
$2N8829: C75.2 R64.1 R65.2 U11.1(ADJ2)
$2N8915: C100.1 U9.5(XI) X2.3(OSC2)
$2N15509: C68.2 U5.6(XO) X1.1(OSC1)
$2N15534: C101.2 U9.6(XO) X2.1(OSC1)

Not connected (* = marked no-connect by the designer): CN1 1* 2* 3* 5* 6* 8* 9* 11* 12* 23* 24* 26* 27* 29* 30* 32* 33* 47* 48* 53* 54* 56* 57* 59* 60* 62* 63* 65* 66* 68* 69* 71* 72* 76* 77* 78* 79* 95* 96*; CN2 2* 3* 5* 6* 8* 9* 10* 12* 13* 17* 18* 19* 23* 24* 25* 27* 28* 32* 34* 35* 36* 38* 40* 41* 46* 47* 48* 50* 52* 55* 56* 63* 64* 73* 75* 76* 77* 78* 81* 82* 83* 85* 86* 87* 88* 91* 92* 93* 95* 96* 98* 99*; CN3 1* 2* 4* 5* 7* 8* 10* 11* 12* 13* 14* 15* 17* 18* 19* 20* 21* 23* 24* 25* 26* 28* 29* 30* 31* 33* 34* 35* 36* 38* 39* 41* 42* 44* 45* 47* 48* 49* 52* 53* 54* 55* 56* 58* 59* 60* 61* 62* 64* 65* 66* 67* 69* 70* 71* 72* 74* 75* 76* 77* 79* 87* 88* 90* 91* 96* 97*; FPC1 20* 21*; FPC2 20* 21*; HDMI1 14(Reserved(N.C.))*; U3 15(NC)* 16(NC)*; U5 4(TDO)* 10(GPIO7)* 18(GPIO8)* 21(GPIO9)* 22(GPIO10)* 25(GPIO11)* 33(GPIO2/LED2)* 34(GPIO3/LED3)* 38(GPIO5/PME)* 40(GPIO6/PME_MODE_SEL)*; U6 3(MR#)*; U8 2(NC)* 5(NC)*; U9 4(TDO)* 10(GPIO7)* 18(GPIO8)* 21(GPIO9)* 22(GPIO10)* 25(GPIO11)* 33(GPIO2/LED2)* 34(GPIO3/LED3)* 38(GPIO5/PME)* 40(GPIO6/PME_MODE_SEL)*; U10 3(MR#)*; U12 2(NC)* 5(NC)*; USB1 A8(SBU1)* B8(SBU2)*

## Notes on the sheets
sheet 1
- RPI CM4
- OPI CM5
- RPI CM4
- OPI CM5
- BPI CM5
- OPI CM4
- RPI CM4
- OPI CM5
- OPI CM5
- OPI CM5
- PCIE_CK_REQ
- PCIE_CK_REQ
- USB_ID
- USB2_ID
- USBC_STX2P
- USB2_H1_P
- PCIE_NWAKE
- 99 - USB_N
- USB2_DM
- ETH_P1_P
- ETH_P3_P
- USBC_STX2N
- USB2_H1_N
- GPIO4_A6
- 98 - USB_P
- USB2_DP
- ETH_P1_N
- ETH_P3_N
- USBC_SRX2P
- USBC_SBU1
- PCIE2_CK_P
- PCIE_CK_P
- PCIE_NRST
- PCIE2_NRST
- USBC_SRX2N
- USBC_SBU2
- PCIE2_CK_N
- PCIE_CK_N
- ETH_P0_N
- ETH_P2_N
- ETH_P0_P
- ETH_P2_P
- USBC_STX1N
- USB2_H0_P
- PCIE2_RX_P
- PCIE_RX_P
- CAM1_D0_N
- CSI0_D0_N
- USBC_STX1P
- USB2_H0_N
- PCIE2_RX_N
- PCIE_RX_N
- CAM1_D0_P
- CSI0_D0_P
- PCIE2_TX_P
- PCIE_TX_P
- CAM1_D1_N
- CSI0_D1_N
- LED_NACT
- GPIO4_A4
- GPIO3_C6
- USBC_SRX1N
- USBC_SRX1P
- PCIE2_TX_N
- PCIE_TX_N
- CAM1_D1_P
- CSI0_D1_P
- GPIO1_C0
- 12 - GPIO26
- GPIO1_C1
- 13 - GPIO19
- 88 - GPIO21
- GPIO1_B0
- DPHY1_CKP
- DPHY0_D0N
- CAM1_CK_N
- CSI0_CK0_N
- GPIO1_A2
- 14 - GPIO18
- 87 - GPIO20
- GPIO1_B1
- DPHY1_CKN
- DPHY0_D0P
- CAM1_CK_P
- CSI0_CK0_P
- GPIO1_A3
- 15 - GPIO6
- 86 - GPIO16
- GPIO1_B2
- DPHY0_D1N
- CAM1_D2_N
- CSI0_D2_N
- GPIO1_A4
- 17 - GPIO5
- 85 - GPIO12
- GPIO1_B3
- GPIO3_B7
- DPHY1_D1N
- DPHY1_D1P
- DPHY0_D1P
- CAM1_D2_P
- CSI0_D2_P
- GPIO1_D7
- GPIO1_D6
- GPIO3_C5
- GPIO1_A5
- 19 - GPIO11
- 82 - GPIO7
- GPIO1_B4
- GPIO3_C4
- DPHY1_D0P
- DPHY0_CKN
- CAM1_D3_N
- CSI0_D3_N
- GPIO1_A6
- 20 - GPIO9
- 81 - GPIO8
- GPIO1_B5
- DPHY1_D0N
- DPHY0_CKP
- CAM1_D3_P
- CSI0_D3_P
- 80 - GPIO25
- GPIO1_B6
- HDMI1_HPD
- GPIO1_A7
- 24 - GPIO10
- HDMI1_SCL
- HDMI1_SDA
- CSI0_CK1_N
- CSI0_CK1_P
- GPIO1_C4
- GPIO1_C6
- 23 - GPIO22
- 24 - GPIO27
- 77 - GPIO23
- 78 - GPIO24
- GPIO0_C2
- GPIO1_B7
- HDMI1_CEC
- GPIO1_D0
- 25 - GPIO17
- 76 - GPIO18
- GPIO1_D5
- HDMI0_CEC
- HDMI0_CEC
- 75 - GPIO15
- UART_TX >
- GPIO3_C1
- HDMI0_HPD
- HDMI0_HPD
- GPIO1_D1
- 27 - GPIO4
- GPIO1_D2
- 28 - GPIO3
- 73 - GPIO14
- UART_RX <
- GPIO1_D3
- 29 - GPIO2
- 72 - SD_CLK
- SD_CLK
- SD_CMD
- 31 - SD_CMD
- 70 - SD_D3
- SD_D3
- 69 - SD_D0
- SD_D0
- GPIO0_B0
- RECOVERY
- 67 - SD_D1
- SD_D1
- HDMI0_T2_P
- HDMI0_T2_P
- 66 - SD_D2
- SD_D2
- HDMI0_T2_N
- HDMI0_T2_N
- GPIO3_C0
- HDMI0_T1_P
- HDMI0_T1_P
- SD_DET_L
- 63 - SD_EN
- SD_EN
- HDMI0_T1_N
- HDMI0_T1_N
- GPIO_VREF
- 39 - VIOREF
- VREF=3.3
- +5V_IN
- +5V_IN
- GPIO0_D5
- I2C6_SCL
- +5V_IN
- +5V_IN
- GPIO0_C7
- HDMI0_T0_P
- HDMI0_T0_P
- I2C6_SDA
- +5V_IN
- +5V_IN
- GPIO0_D4
- HDMI0_T0_N
- HDMI0_T0_N
- +3.3V_OUT
- +3.3V_OUT
- +3.3V_OUT
- +3.3V_OUT
- +5V_IN
- +5V_IN
- +5V_IN
- +5V_IN
- GPIO0_C4
- GPIO0_D3
- HDMI0_CK_P
- HDMI0_CK_P
- +1.8V_OUT
- +1.8V_OUT
- +5V_IN
- +5V_IN
- HDMI0_CK_N
- HDMI0_CK_N
- +1.8V_OUT
- +1.8V_OUT
- GPIO0_D0
- 54 - NBOOT
- BOOT_SW
- GPIO3_C5
- GPIO4_A3
- LED_PWR
- GPIO4_B6
- GPIO0_B2
- GPIO4_B3
- HDMI0_SCL
- HDMI0_SCL
- HDMI0_SDA
- HDMI0_SDA
- GPIO4_A5
- 51 - EN
- GPIO4_A7
- PWRON_L
- GPIO0_C6
- GPIO4_B2
- Compute Module CN1
- Compute Module CN2
- Compute Module CN3 (Orange Pi CM5 only)
- USB for Power Input
- Mini HDMI
- SD Card & Settings
- LEDs
- (GPIO1_B6)
- (GPIO1_D3)
- (GPIO1_A3)
- (GPIO1_A6)
- (GPIO1_A2)
- (GPIO1_A7)
- Power Supply
- Power Supply for Cameras
- CSI Camera
- CSI_Camera (Orange Pi CM5 DPHY0 RX)
sheet 2
- USB to Ethernet
- USB to Ethernet
